# Altium schematic sheet ESP32_DevKitC_v4_shim.SchDoc
size A4
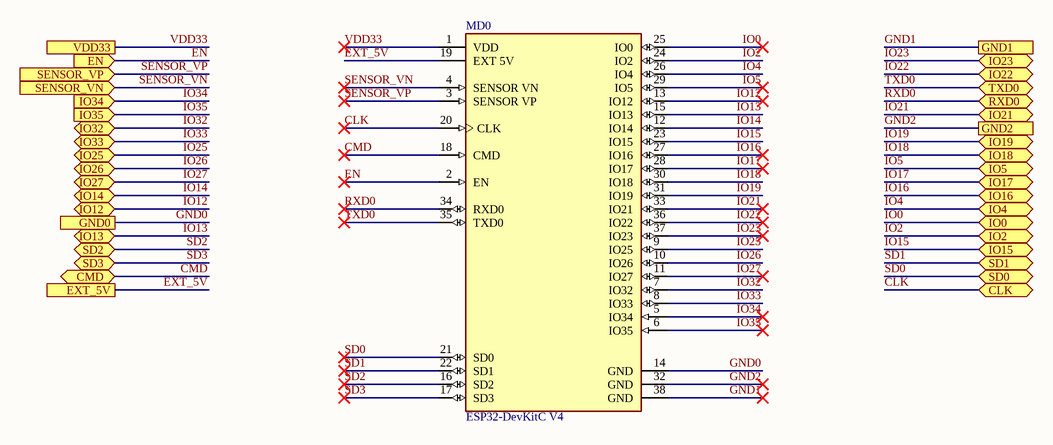
[diagram p0: ESP32_DevKitC_v4_shim.SchDoc]

## Parts
MD0  ESP32-DevKitC V4  [FP-ESP32-DevKitC_V4-MFG]

## Ports
CLK (bidir), CMD (bidir), EN (in), EXT_5V, GND0, GND1, GND2, IO0 (bidir), IO2 (bidir), IO4 (bidir), IO5 (bidir), IO12 (bidir), IO13 (bidir), IO14 (bidir), IO15 (bidir), IO16 (bidir), IO17 (bidir), IO18 (bidir), IO19 (bidir), IO21 (bidir), IO22 (bidir), IO23 (bidir), IO25 (bidir), IO26 (bidir), IO27 (bidir), IO32 (bidir), IO33 (bidir), IO34 (in), IO35 (in), RXD0 (bidir), SD0 (bidir), SD1 (bidir), SD2 (bidir), SD3 (bidir), SENSOR_VN (in), SENSOR_VP (in), TXD0 (bidir), VDD33

## Nets
CLK: MD0.20(CLK) ; port CLK
CMD: MD0.18(CMD) ; port CMD
EN: MD0.2(EN) ; port EN
EXT_5V: MD0.19(EXT_5V) ; port EXT_5V
GND0: MD0.14(GND) ; port GND0
GND1: MD0.38(GND) ; port GND1
GND2: MD0.32(GND) ; port GND2
IO0: MD0.25(IO0) ; port IO0
IO2: MD0.24(IO2) ; port IO2
IO4: MD0.26(IO4) ; port IO4
IO5: MD0.29(IO5) ; port IO5
IO12: MD0.13(IO12) ; port IO12
IO13: MD0.15(IO13) ; port IO13
IO14: MD0.12(IO14) ; port IO14
IO15: MD0.23(IO15) ; port IO15
IO16: MD0.27(IO16) ; port IO16
IO17: MD0.28(IO17) ; port IO17
IO18: MD0.30(IO18) ; port IO18
IO19: MD0.31(IO19) ; port IO19
IO21: MD0.33(IO21) ; port IO21
IO22: MD0.36(IO22) ; port IO22
IO23: MD0.37(IO23) ; port IO23
IO25: MD0.9(IO25) ; port IO25
IO26: MD0.10(IO26) ; port IO26
IO27: MD0.11(IO27) ; port IO27
IO32: MD0.7(IO32) ; port IO32
IO33: MD0.8(IO33) ; port IO33
IO34: MD0.5(IO34) ; port IO34
IO35: MD0.6(IO35) ; port IO35
RXD0: MD0.34(RXD0) ; port RXD0
SD0: MD0.21(SD0) ; port SD0
SD1: MD0.22(SD1) ; port SD1
SD2: MD0.16(SD2) ; port SD2
SD3: MD0.17(SD3) ; port SD3
SENSOR_VN: MD0.4(SENSOR_VN) ; port SENSOR_VN
SENSOR_VP: MD0.3(SENSOR_VP) ; port SENSOR_VP
TXD0: MD0.35(TXD0) ; port TXD0
VDD33: MD0.1(VDD) ; port VDD33

## Library data of the parts
MD0 = CMP-194065-000004-1: WiFi Development Tools (802.11) ESP32 General Development Kit, ESP32-WROOM-32 on the board; Manufacturer: Espressif; Number Of Adc Channels: 16; Max Supply Voltage: 5V; Bandwidth: 2.4-2.5GHz; Interface: I2C,SPI,UART,I2S; Max Frequency: 2.5GHz; Min Supply Voltage: 2.7V; Number Of Gpio: 22; Package: ESP32-DevKitC V4; Device Class L2: RF Semiconductors and Devices; Device Class L3: Transceivers; ComponentLink2Description: Datasheet; Temperature Range Low: -40°C; ComponentLink2URL: https://docs.espressif.com/projects/esp-idf/en/latest/get-started/get-started-devkitc.html; RoHS: TRUE; Category: UNK; Automotive: No; Device Class L1: Integrated Circuits (ICs); Manufacturer Part Number: ESP32-DevKitC V4; Octopart: https://octopart.com/esp32-devkitc+v4-espressif+systems-107467262; Lead Free: Yes; Temperature: -40°C to